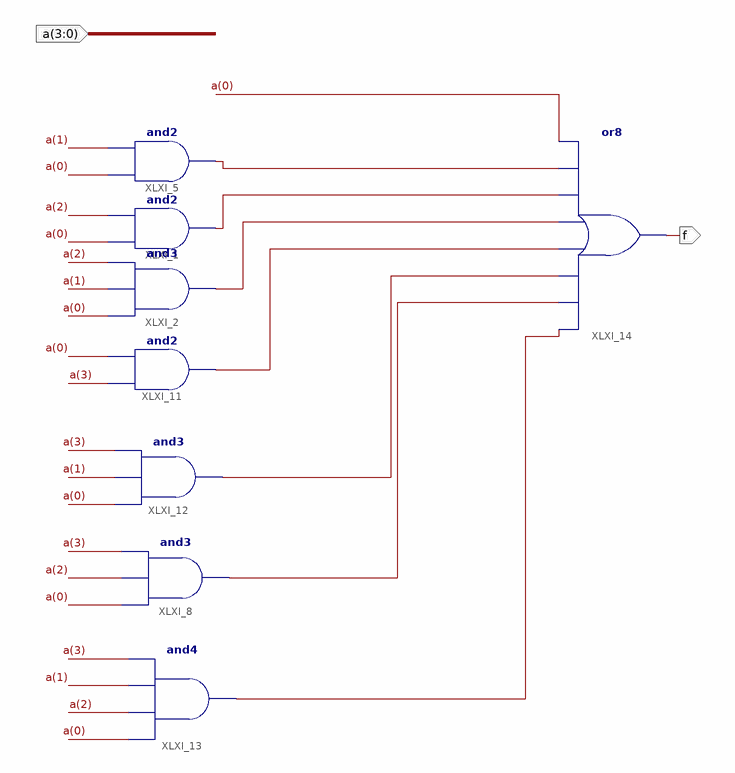
[diagram p0: schematic sheet 1]
// Xilinx ISE schematic main.sch (spartan3e) as structural Verilog: 8 symbols, 2 ports
module main (
  input  [3:0] a,
  output f
);

  wire XLXN_2, XLXN_3, XLXN_8, XLXN_14, XLXN_60, XLXN_61, XLXN_62;

  and XLXI_1 (XLXN_3, a[0], a[2]);
  and XLXI_2 (XLXN_14, a[0], a[1], a[2]);
  and XLXI_5 (XLXN_2, a[0], a[1]);
  and XLXI_8 (XLXN_62, a[0], a[2], a[3]);
  and XLXI_11 (XLXN_60, a[3], a[0]);
  and XLXI_12 (XLXN_61, a[0], a[1], a[3]);
  and XLXI_13 (XLXN_8, a[0], a[2], a[1], a[3]);
  or XLXI_14 (f, XLXN_8, XLXN_62, XLXN_61, XLXN_60, XLXN_14, XLXN_3, XLXN_2, a[0]);
endmodule
